# EAGLE design Control Box 3.0 (EAGLE 9.3.1)
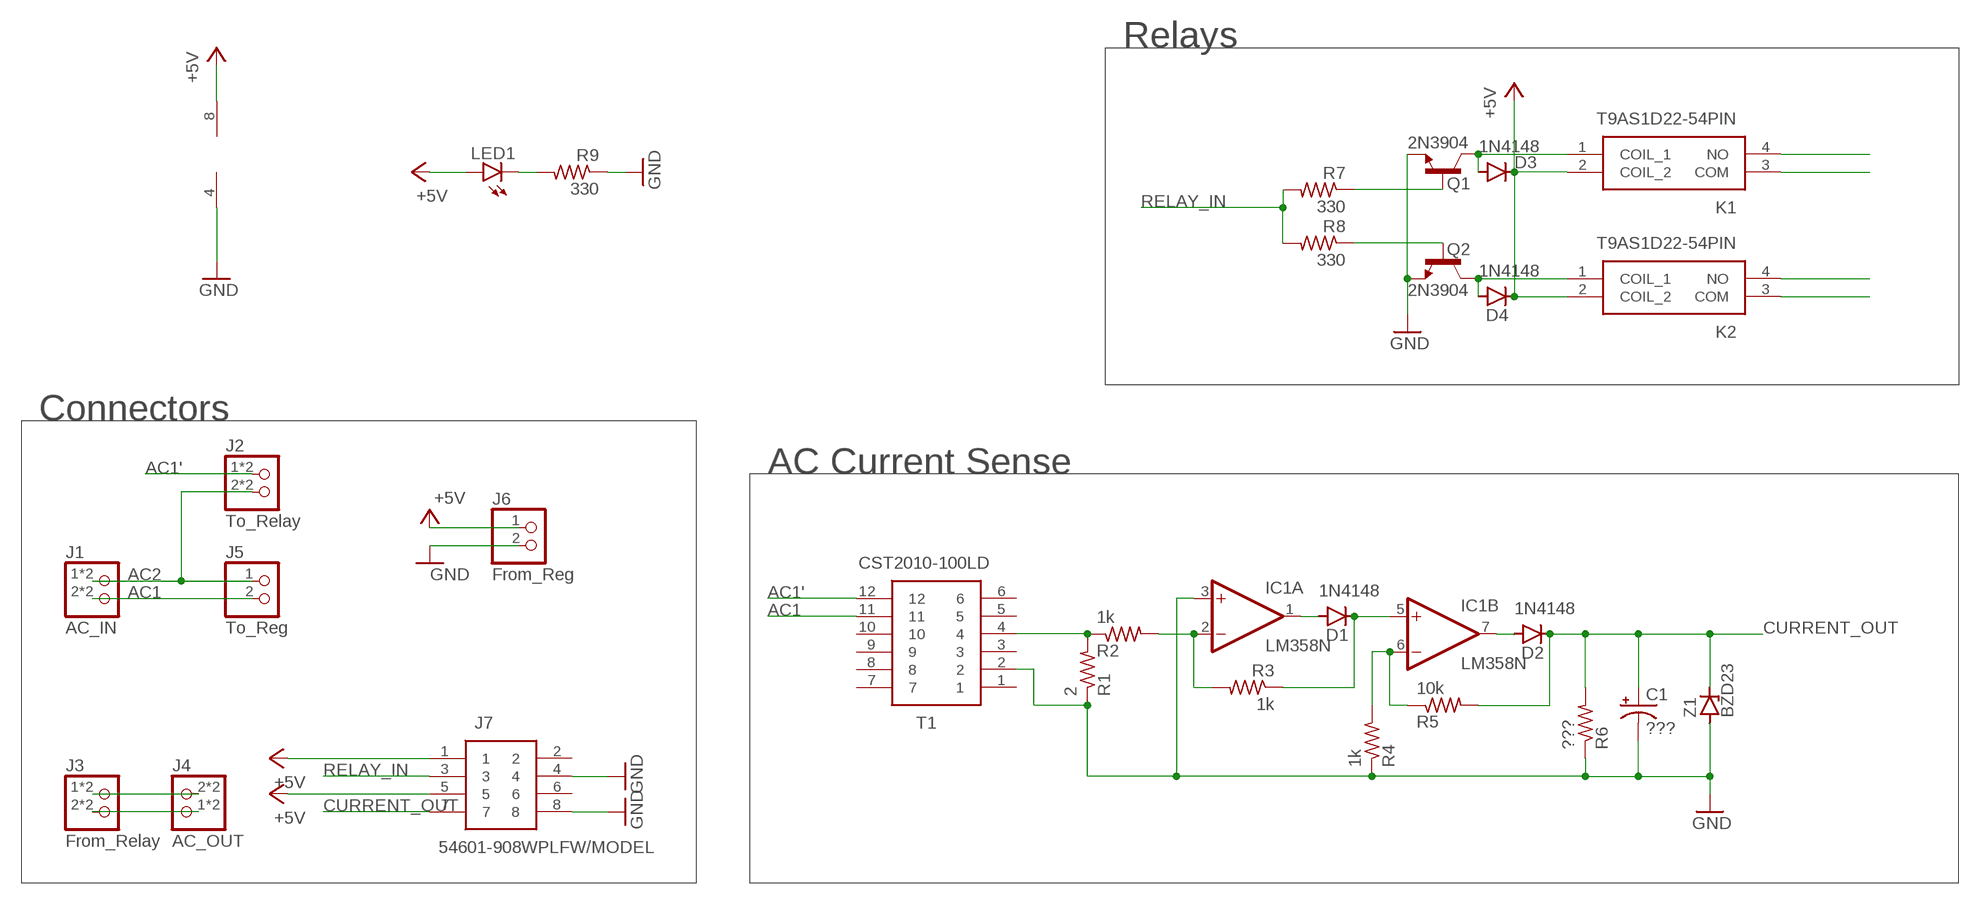
[diagram p0: schematic, sheet 1]

## Parts
C1  ???  CPOL-USE1.8-4  [E1,8-4]
D1  1N4148  1N4148DO35-7  [DO35-7]
D2  1N4148  1N4148DO35-7  [DO35-7]
D3  1N4148  1N4148DO35-7  [DO35-7]
D4  1N4148  1N4148DO35-7  [DO35-7]
IC1  LM358N  [DIL08]
J1  AC_IN  VC0200500000GVC0200500000G  [HDRRA4W64P762_2X2_1016X254X556B]
J2  To_Relay  VC0200500000GVC0200500000G  [HDRRA4W64P762_2X2_1016X254X556B]
J3  From_Relay  VC0200500000GVC0200500000G  [HDRRA4W64P762_2X2_1016X254X556B]
J4  AC_OUT  VC0200500000GVC0200500000G  [HDRRA4W64P762_2X2_1016X254X556B]
J5  To_Reg  VH_1X2GAP  [HDRV2W64P792_1X2_1016X508X838B]
J6  From_Reg  VH_1X2  [HDRV2W165P396_1X2_1016X508X838B]
J7  54601-908WPLFW/MODEL  [HDRV4W64P254_1X4_1016X508X838B]
K1  T9AS1D22-54PIN  [T9AS5D1212313932103-2]
K2  T9AS1D22-54PIN  [T9AS5D1212313932103-2]
LED1  LED5MM  [LED5MM]
Q1  2N3904  [TO92]
Q2  2N3904  [TO92]
R1  2  R-US  [0204/7]
R2  1k  R-US  [0204/7]
R3  1k  R-US  [0204/7]
R4  1k  R-US  [0204/7]
R5  10k  R-US  [0204/7]
R6  ???  R-US  [0204/7]
R7  330  R-US  [0204/7]
R8  330  R-US  [0204/7]
R9  330  R-US  [0204/7]
T1  CST2010-100LD  [CST2010100LD]
Z1  BZD23  [SOD81]

## Nets
+5V [DC Power]: D3.C D4.C IC1.8(P:V+) J6.1 J7.1 J7.5 K1.2(COIL_2) K2.2(COIL_2) LED1.A
AC1 [Mains Power]: J1.2 J1.3 J5.2 T1.11
AC1' [Mains Power]: J2.1 J2.4 T1.12
AC2 [Mains Power]: J1.1 J1.4 J2.2 J2.3 J5.1
CURRENT_OUT: C1.+ D2.C J7.7 R5.2 R6.2 Z1.C
GND [DC Power]: C1.- IC1.3(A:+IN) IC1.4(P:V-) J6.2 J7.4 J7.8 Q1.3(E) Q2.3(E) R1.1 R4.1 R6.1 R9.1 T1.2 Z1.A
N$1 [Mains Power]: J3.1 J3.4 J4.2 J4.3
N$2: R1.2 R2.1 T1.4
N$3: D1.A IC1.1(A:OUT)
N$4 [Mains Power]: J3.2 J3.3 J4.1 J4.4
N$5: D1.C IC1.5(B:+IN) R3.1
N$6: IC1.6(B:-IN) R4.2 R5.1
N$7: IC1.2(A:-IN) R2.2 R3.2
N$8: D3.A K1.1(COIL_1) Q1.1(C)
N$9: D2.A IC1.7(B:OUT)
N$10: K1.4(NO)
N$11: D4.A K2.1(COIL_1) Q2.1(C)
N$12: K1.3(COM)
N$13: K2.4(NO)
N$14: Q1.2(B) R7.1
N$15: Q2.2(B) R8.1
N$16: K2.3(COM)
N$17: LED1.K(C) R9.2
RELAY_IN: J7.3 R7.2 R8.2
Unconnected: J7.2 J7.6 T1.1 T1.3 T1.5 T1.6 T1.7 T1.8 T1.9 T1.10

## Notes on the sheet
- Relays
- Connectors
- AC Current Sense

## Library data of the parts
C1 = rcl:CPOL-US: POLARIZED CAPACITOR, American symbol; SPICEPREFIX: C
D1-D4 = diode:1N4148: DIODE high speed (Philips)
IC1 = linear:LM358: OP AMP also LM158; LM258; LM2904 Source: http://cache.national.com/ds/LM/LM158.pdf
J1-J4 = mcp:VC0200500000G
J5 J6 = mcp:VH_1X2
J7 = mcp:54601-908WPLF: Modular Connectors / Ethernet Connectors 8P8C CAT 3 MOD JACK HORIZ. 1 PORT Source: Datasheet <https://www.mouser.ch/datasheet/2/18/c-bmj-0051-1365214.pdf>
K1 K2 = mcp:T9AS1D22-5: PWR PCB RELAYS Source: Datasheet <https://componentsearchengine.com/Datasheets/1/T9AS1D22-5.pdf>
LED1 = led:LED: LED OSRAM: - CHIPLED LG R971, LG N971, LY N971, LG Q971, LY Q971, LO R971, LY R971 LH N974, LH R974 LS Q976, LO Q976, LY Q976 LO Q996 - Hyper CHIPLED LW Q18S LB Q993, LB Q99A, LB R99A - SideLED LS A670, LO A670, LY A670, LG A670, LP A670 LB A673, LV A673, LT A673, LW A673 LH A674 LY A675 LS A676, LA A676, LO A676, LY A676, LW A676 LS A679, LY A679, LG A679 - Hyper Micro SIDELED® LS Y876, LA Y876, LO Y876, LY Y876 LT Y87S - SmartLED LW L88C, LW L88S LB L89C, LB L89S, LG L890 LS L89K, LO L89K, LY L89K LS L896, LA L896, LO L896, LY L896 - TOPLED LS T670, LO T670, LY T670, LG T670, LP T670 LSG T670, LSP T670, LSY T670, LOP T670, LYG T670 LG T671, LOG T671, LSG T671 LB T673, LV T673, LT T673, LW T673 LH T674 LS T676, LA T676, LO T676, LY T676, LB T676, LH T676, LSB T676, LW T676 LB T67C, LV T67C, LT T67C, LS T67K, LO T67K, LY T67K, LW E67C LS E67B, LA E67B, LO E67B, LY E67B, LB E67C, LV E67C, LT E67C LW T67C LS T679, LY T679, LG T679 LS T770, LO T770, LY T770, LG T770, LP T770 LB T773, LV T773, LT T773, LW T773 LH T774 LS E675, LA E675, LY E675, LS T675 LS T776, LA T776, LO T776, LY T776, LB T776 LHGB T686 LT T68C, LB T68C - Hyper Mini TOPLED® LB M676 - Mini TOPLED Santana® LG M470 LS M47K, LO M47K, LY M47K Source: http://www.osram.convergy.de LUXEON: - LUMILED® LXK2-PW12-R00, LXK2-PW12-S00, LXK2-PW14-U00, LXK2-PW14-V00 LXK2-PM12-R00, LXK2-PM12-S00, LXK2-PM14-U00 LXK2-PE12-Q00, LXK2-PE12-R00, LXK2-PE12-S00, LXK2-PE14-T00, LXK2-PE14-U00 LXK2-PB12-K00, LXK2-PB12-L00, LXK2-PB12-M00, LXK2-PB14-N00, LXK2-PB14-P00, LXK2-PB14-Q00 LXK2-PR12-L00, LXK2-PR12-M00, LXK2-PR14-Q00, LXK2-PR14-R00 LXK2-PD12-Q00, LXK2-PD12-R00, LXK2-PD12-S00 LXK2-PH12-R00, LXK2-PH12-S00 LXK2-PL12-P00, LXK2-PL12-Q00, LXK2-PL12-R00 Source: www.luxeon.com KINGBRIGHT: KA-3528ASYC Source: www.kingbright.com
Q1 Q2 = transistor:2N3904: NPN TRANSISTOR
R1-R9 = mcp:R-US
T1 = mcp:CST2010-100LD: Current Transformers 40A 8.5mH 2.5 Ohms AEC-Q200 Source: Datasheet <https://componentsearchengine.com/Datasheets/1/CST2010-100LD.pdf>; DESCRIPTION: Current Transformers 40A 8.5mH 2.5 Ohms AEC-Q200; HEIGHT: 10mm; MANUFACTURER_NAME: COILCRAFT; MANUFACTURER_PART_NUMBER: CST2010-100LD; MOUSER_PART_NUMBER: 994-CST2010-100LD; MOUSER_PRICE-STOCK: https://www.mouser.com/Search/Refine.aspx?Keyword=994-CST2010-100LD
Z1 = diode:BZD23: Z DIODE

## Net classes
1 Mains Power: width 3.048 mm, clearance 3.81 mm to class 0, clearance 3.81 mm
2 DC Power: width 0.508 mm, clearance 0.254 mm to class 0, clearance 3.81 mm to class 1, clearance 0.254 mm

## Board
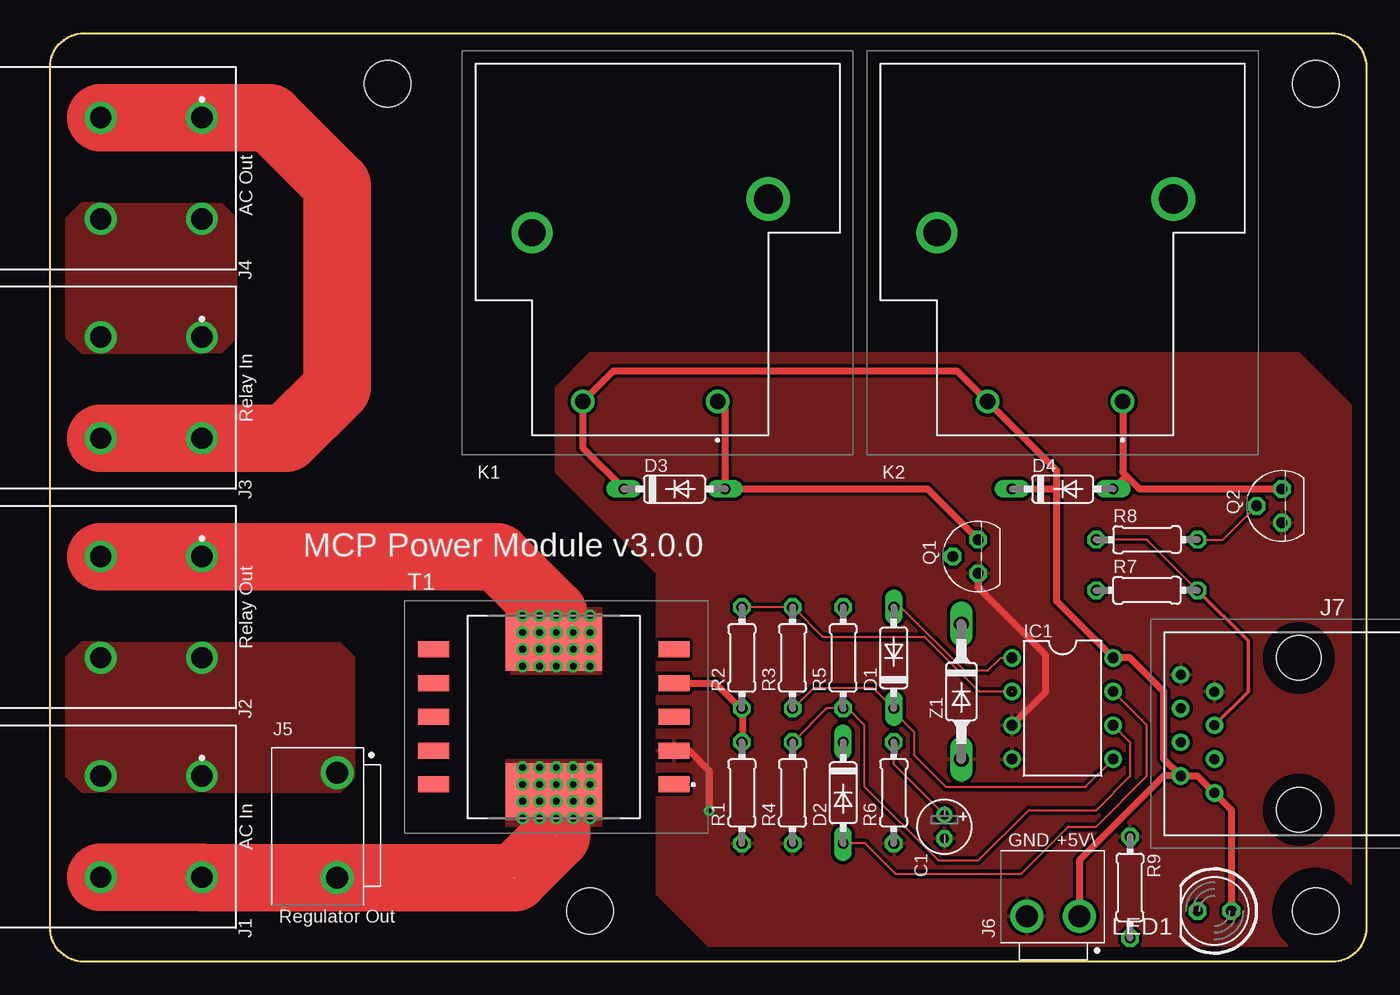
[diagram p1: board, top side]
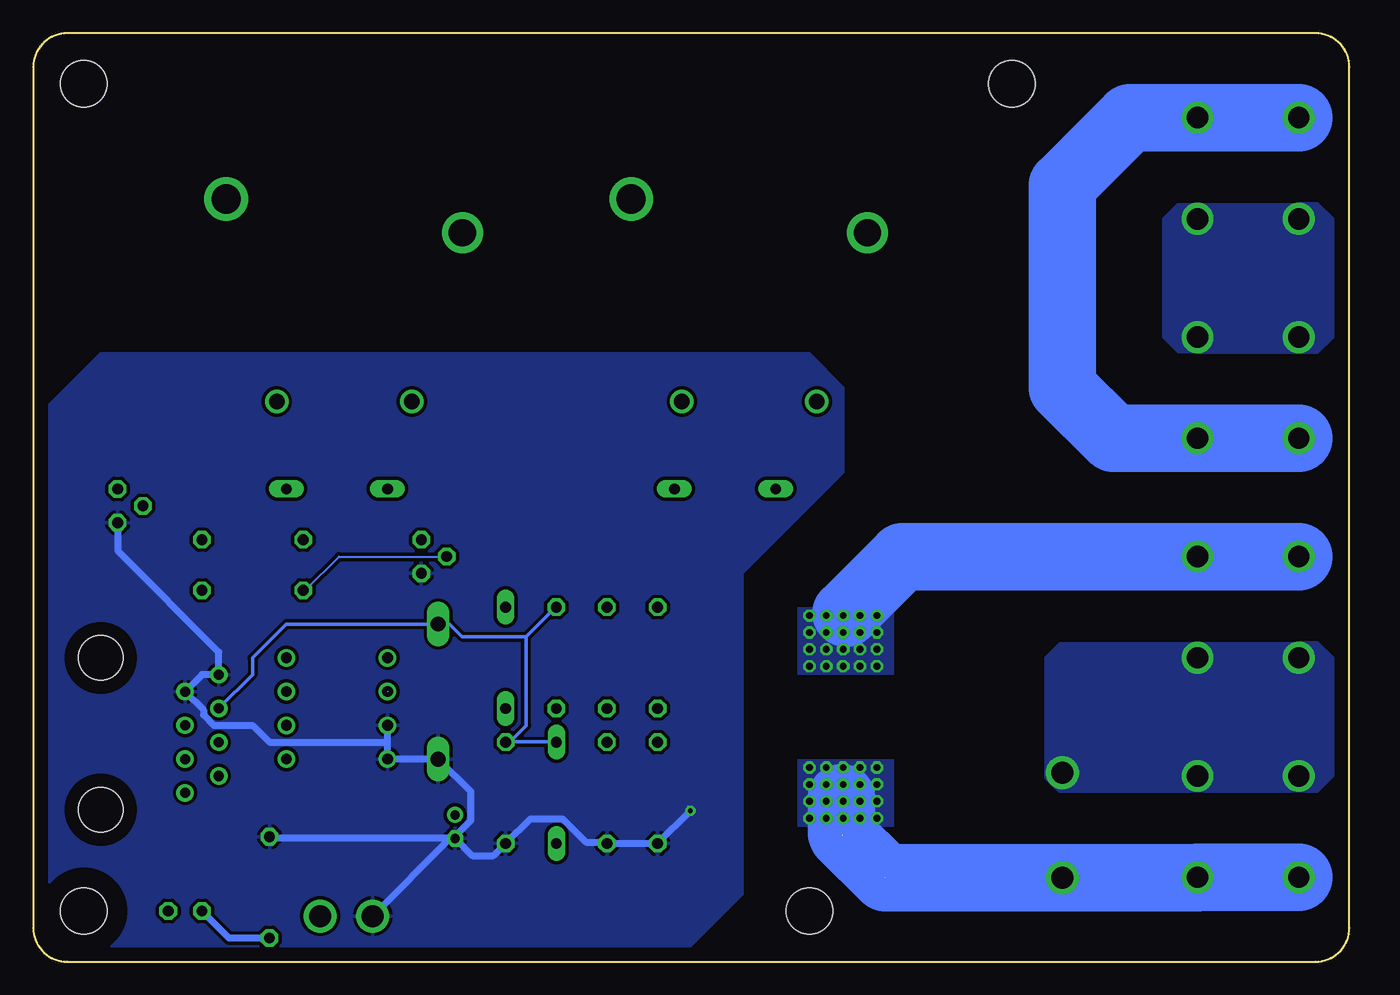
[diagram p2: board, bottom side, seen from below]

Size 99.06 x 69.85 mm. Coordinates in mm from the lower left corner, seen from the top.
Outline: 0,2.54 0,67.31 arc-90 2.54,69.85 96.52,69.85 arc-90 99.06,67.31 99.06,2.54 arc-90 96.52,0 2.54,0 arc-90 0,2.54
Copper layers (1*16): Top 0.035mm / dielectric 1.5mm / Bottom 0.035mm
Design rules "default *": minimum track width 6mil, minimum drill 0.35mm, track to track 6mil, track to pad 6mil, pad to pad 6mil, via to via 6mil, smd to smd 6mil, copper to edge 40mil, drill to drill 6mil, minimum pad ring 10mil, minimum via ring 8mil, stop-mask expansion 4mil, vias tented up to drill 0mil, thermal gap 10mil
Holes 3.5 mm at 95.25,66.04 25.4,66.04 40.64,3.81 95.25,3.81
tRestrict: area 92,62.8 to 98.5,69.3; area 22.1,62.8 to 28.6,69.3; area 37.4,0.6 to 43.9,7.1; area 92,0.6 to 98.5,7.1
bRestrict: area 92,0.6 to 98.5,7.1; area 37.4,0.6 to 43.9,7.1; area 92,62.8 to 98.5,69.3; area 22.1,62.8 to 28.6,69.3

### Footprints (pad centres in the part's own frame; a part is rotated, then mirrored left to right if it is on the bottom)
E1,8-4 = drill 0.711 pad 1.168: + -0.889,0 | drill 0.711 pad 1.168 octagon: - 0.889,0
DO35-7 = drill 0.813 long: A 3.81,0; C -3.81,0
DIL08 = drill 0.813 pad 1.27: 1 -3.81,-3.81; 2 -1.27,-3.81; 3 1.27,-3.81; 4 3.81,-3.81; 5 3.81,3.81; 6 1.27,3.81; 7 -1.27,3.81; 8 -3.81,3.81
HDRRA4W64P762_2X2_1016X254X556B = drill 1.6: 1 0,0; 2 7.62,0; 3 7.62,-7.62; 4 0,-7.62
HDRV2W64P792_1X2_1016X508X838B = drill 1.648: 1 0,0; 2 7.92,0
HDRV2W165P396_1X2_1016X508X838B = drill 1.648: 1 0,0; 2 3.96,0
HDRV4W64P254_1X4_1016X508X838B = drill 0.76 pad 1.303: 1 0,0; 2 2.54,0; 3 5.08,0; 4 7.62,0; 5 1.27,2.54; 6 3.81,2.54; 7 6.35,2.54; 8 8.89,2.54 | hole 3.35: -1.271,-6.35; 10.161,-6.35
T9AS5D1212313932103-2 = drill 1.17 pad 1.755: 1 4.525,-11.2; 2 -5.635,-11.2 | drill 2.19 pad 3.285: 3 8.335,4.04 | drill 2.06 pad 3.09: 4 -9.445,1.5
LED5MM = drill 0.813 octagon: A -1.27,0; K 1.27,0
TO92 = drill 0.813 octagon: 1 1.27,0; 2 0,1.905; 3 -1.27,0
0204/7 = drill 0.813 octagon: 1 -3.81,0; 2 3.81,0
CST2010100LD = smd 2.34 x 1.19: 1 -8.845,5.08; 2 -8.845,2.54; 3 -8.845,0; 4 -8.845,-2.54; 5 -8.845,-5.08; 6 9.235,-5.08; 7 9.235,-2.54; 8 9.235,0; 9 9.235,2.54; 10 9.235,5.08 | smd 7.24 x 4.27: 11 0.195,5.62; 12 0.195,-5.62
SOD81 = drill 1.118 long: A 5.08,0; C -5.08,0

### Placement (x,y rotation side)
C1  67.31,10.16 270 top
D1  63.5,22.86 90 top
D2  59.69,12.7 270 top
D3  46.99,35.56 0 top
D4  76.2,35.56 0 top
IC1  76.2,19.05 270 top
J1  11.43,13.97 270 top
J2  11.43,30.48 270 top
J3  11.43,46.99 270 top
J4  11.43,63.5 270 top
J5  21.59,14.22 270 top
J6  77.47,3.43 180 top
J7  87.63,12.7 90 top
K1  45.72,53.34 0 top
K2  76.2,53.34 0 top
LED1  87.63,3.81 180 top
Q1  69.85,30.48 90 top
Q2  92.71,34.29 90 top
R1  52.07,12.7 90 top
R2  52.07,22.86 90 top
R3  55.88,22.86 90 top
R4  55.88,12.7 90 top
R5  59.69,22.86 90 top
R6  63.5,12.7 90 top
R7  82.55,27.94 0 top
R8  82.55,31.75 180 top
R9  81.28,5.59 270 top
T1  38.1,18.41 180 top
Z1  68.58,20.32 270 top

### Tracks (layer width: path | path; a pad name or v marks a point on that pad's centre or on a via)
+5V
  Top 0.508: D4.C 75.77,35.56 | 75.77,35.56 75.77,36.94 K2.2 68.25,44.45 42.4,44.45 K1.2 40.09,38.66 D3.C | J7.5 86.36,13.97 J7.1 88.9,11.43 LED1.A | J7.5 83.82,15.24 83.82,20.32 81.28,22.86 IC1.8 75.77,27.1 75.77,35.56 | J7.5 83.82,13.97 77.47,7.62 J6.1
AC1  (via drill 0.51)  (3 unrouted)
  Top 5.08: J1.3 J1.2 11.48,6.3 J5.2 34.95,6.3 38.1,9.46 v38.1,12.06
  Bottom 5.08: J1.2 J1.3 | 20.27,6.3 11.43,6.3 | 34.92,6.3 20.3,6.3 | 35.01,6.37 38.16,9.53 | 38.23,9.71 38.23,12.32
  other vias: 36.83,10.79 36.83,12.06 36.83,13.34 38.1,13.34 39.37,13.34 39.37,12.06 39.37,10.79 38.1,10.79 38.1,14.61 39.37,14.61 36.83,14.61 35.56,13.34 35.56,12.06 40.64,12.06 40.64,13.34 35.56,10.79 40.64,10.79 40.64,14.61 35.56,14.61
  pour Bottom (isolate 0.305): 34.29,15.24 34.29,10.16 41.53,10.16 41.53,15.24
  pour Top (isolate 0.305, no thermals): 41.53,15.24 41.53,10.16 34.29,10.16 34.29,15.24
AC1'  (via drill 0.51)
  Top 5.08: 37.91,26.23 33.66,30.48 J2.1 J2.4
  Bottom 5.08: J2.4 J2.1 33.66,30.48 37.91,26.23
  other vias: 39.37,24.77 39.37,23.5 38.1,24.77 38.1,23.5 36.83,23.5 36.83,24.77 39.37,26.04 38.1,26.04 36.83,26.04 36.83,22.23 38.1,22.23 39.37,22.23 40.64,23.5 40.64,24.77 40.64,26.04 35.56,26.04 35.56,24.77 35.56,23.5 40.64,22.23 35.56,22.23
  pour Bottom: 34.29,26.67 34.29,21.59 41.53,21.59 41.53,26.67
  pour Top (no thermals): 41.53,26.67 41.53,21.59 34.67,21.59 34.67,26.67
AC2
  pour Top (no thermals): 1.27,22.86 2.41,24 21.72,24 22.86,22.86 22.86,13.84 21.84,12.83 2.41,12.83 1.27,13.97
  pour Bottom (no thermals): 1.27,22.86 2.41,24 21.72,24 22.86,22.86 22.86,13.84 21.84,12.83 2.41,12.83 1.27,13.97
CURRENT_OUT
  Top 0.152: R6.2 63.5,14.86 C1.+
  Bottom 0.152: 59.74,26.67 R5.2 | 59.74,16.54 D2.C
  Bottom 0.254: 61.95,24.46 59.74,26.67 | 61.95,24.46 66.78,24.46 67.72,25.4 Z1.C 80.01,25.4 82.55,22.86 82.55,21.59 J7.7 | 63.17,16.54 59.74,16.54 | 61.95,24.46 61.95,17.75 63.17,16.54 | R6.2 63.48,16.54 63.17,16.54
GND  (via drill 0.35)
  Top 0.508: v49.61,11.35 49.61,14.38 48.11,15.88 T1.2 | Q1.3 69.85,28.14 74.93,23.06 74.93,20.32 IC1.3
  Bottom 0.508: Q2.3 92.66,33.02 92.66,30.86 85.09,23.29 J7.8 86.36,21.59 J7.4 86.25,18.94 86.25,18.57 85.46,17.78 82.55,17.78 81.28,16.51 72.39,16.51 | v49.61,11.35 R1.1 52.12,8.91 55.85,8.91 R4.1 56.08,8.99 57.45,8.99 59.21,10.74 61.65,10.74 R6.1 64.41,7.98 66.02,7.98 C1.- | C1.- 67.28,9.32 67.28,9.47 66.14,10.62 66.14,12.8 Z1.A IC1.4 72.39,16.51 | 72.39,16.51 IC1.3 | R9.1 81.15,9.27 C1.- | J6.2 67.67,9.27 C1.-
  pour Top: 99.06,0 50.8,0 45.72,5.08 45.72,29.21 38.1,36.83 38.1,43.18 40.64,45.72 93.98,45.72 99.06,40.64
  pour Bottom: 99.06,0 50.8,0 45.72,5.08 45.72,29.21 38.1,36.83 38.1,43.18 40.64,45.72 93.98,45.72 99.06,40.64
N$1
  pour Top (no thermals): 1.27,46.99 1.27,55.88 2.41,57.02 12.83,57.02 13.97,55.88 13.97,46.99 12.83,45.85 2.41,45.85
  pour Bottom (no thermals): 1.27,46.99 1.27,55.88 2.41,57.02 12.83,57.02 13.97,55.88 13.97,46.99 12.83,45.85 2.41,45.85
N$2
  Top 0.152: 51.97,19.05 R2.1 52.12,19.05 | 47.09,20.9 T1.4 | 52.12,17.37 52.05,17.3 52.05,16.54 R1.2
  Top 0.508: 47.09,20.9 50.11,20.9 51.97,19.05 | 52.12,19.05 52.12,17.37
N$3
  Top 0.152: D1.A 64.03,26.67 68.83,21.87 70.56,21.87 71.34,22.64 71.55,22.86 IC1.1
N$4
  Top 5.08: J3.3 J3.2 17.78,39.37 21.59,43.18 21.59,58.42 16.51,63.5 J4.1 J4.4
  Bottom 5.08: J4.4 J4.1 16.51,63.5 21.59,58.42 21.59,43.18 17.78,39.37 J3.2 J3.3
N$5
  Top 0.152: R3.1 55.93,19.05 57.45,20.57 61.95,20.57 63.48,19.05 D1.C 63.55,19.05 63.55,18.75 65,17.3 65,15.57 67.41,13.16 71.93,13.16 77.93,13.16 IC1.5
N$6
  Top 0.152: R4.2 55.93,16.54 58.45,19.05 R5.1 60.05,19.05 61.27,17.83 61.27,13.21 66.85,7.62 69.85,7.62 73.67,11.4 78.74,11.4 81.28,13.95 81.28,16.51 IC1.6
N$7  (1 unrouted)
  Top 0.152: R2.2 R3.2 55.93,26.67 58.14,24.46 65.79,24.46 69.9,20.34 72.39,20.34
N$8
  Top 0.508: K1.1 50.8,41.59 D3.A 66.04,35.56 Q1.1
N$9
  Top 0.152: D2.A 59.74,8.91 61.34,8.91 63.63,6.63 73.1,6.63 76.63,10.16 78.74,10.16 82.55,13.97 82.55,17.78 IC1.7
N$11
  Top 0.508: K2.1 80.72,36.83 81,36.55 | 81,36.55 82,35.56 Q2.1 | 81,36.55 D4.A
N$14
  Bottom 0.152: R7.1 78.72,27.96 78.56,27.96 76.05,30.48 Q1.2
N$15
  Top 0.152: Q2.2 88.27,31.75 R8.1
N$17
  Bottom 0.508: R9.2 84.33,1.78 LED1.K
RELAY_IN
  Top 0.152: R7.2 82.55,31.75 R8.2
  Top 0.254: J7.3 90.17,20.32 90.17,24.13 R7.2

### Text on the board
tPlace: MCP Power Module v3.0.0
tNames: AC Out | Relay In | Relay Out | AC In | GND | +5V\ | Regulator Out